# Altium schematic sheet microSD.SchDoc
size A4
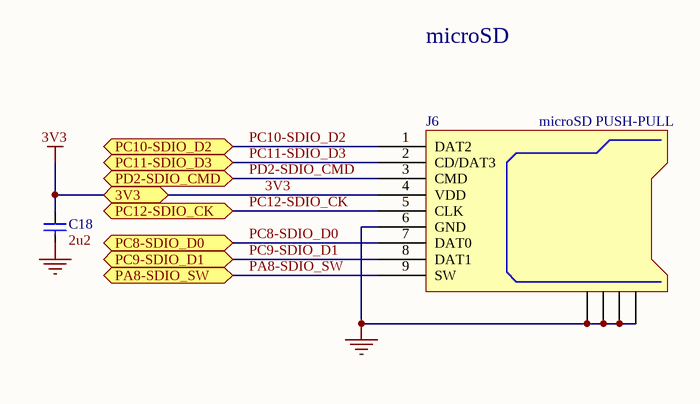
[diagram p0: microSD.SchDoc]

## Parts
C18  2u2  [SMD0603]
J6  microSD PUSH-PULL  [microSD-1]

## Ports
3V3, PA8-SDIO_SW, PC8-SDIO_D0, PC9-SDIO_D1, PC10-SDIO_D2, PC11-SDIO_D3, PC12-SDIO_CK, PD2-SDIO_CMD

## Nets
3V3: C18.2 J6.4(VDD) ; port 3V3
GND: C18.1 J6.6(GND) J6.GP1 J6.GP2 J6.GP3 J6.GP4
PA8-SDIO_SW: J6.9(SW) ; port PA8-SDIO_SW
PC8-SDIO_D0: J6.7(DAT0) ; port PC8-SDIO_D0
PC9-SDIO_D1: J6.8(DAT1) ; port PC9-SDIO_D1
PC10-SDIO_D2: J6.1(DAT2) ; port PC10-SDIO_D2
PC11-SDIO_D3: J6.2(CD/DAT3) ; port PC11-SDIO_D3
PC12-SDIO_CK: J6.5(CLK) ; port PC12-SDIO_CK
PD2-SDIO_CMD: J6.3(CMD) ; port PD2-SDIO_CMD

## Notes on the sheet
- microSD

## Library data of the parts
C18 = Cap